# Altium schematic sheet MB988.SchDoc
size A3; Revision: B.2
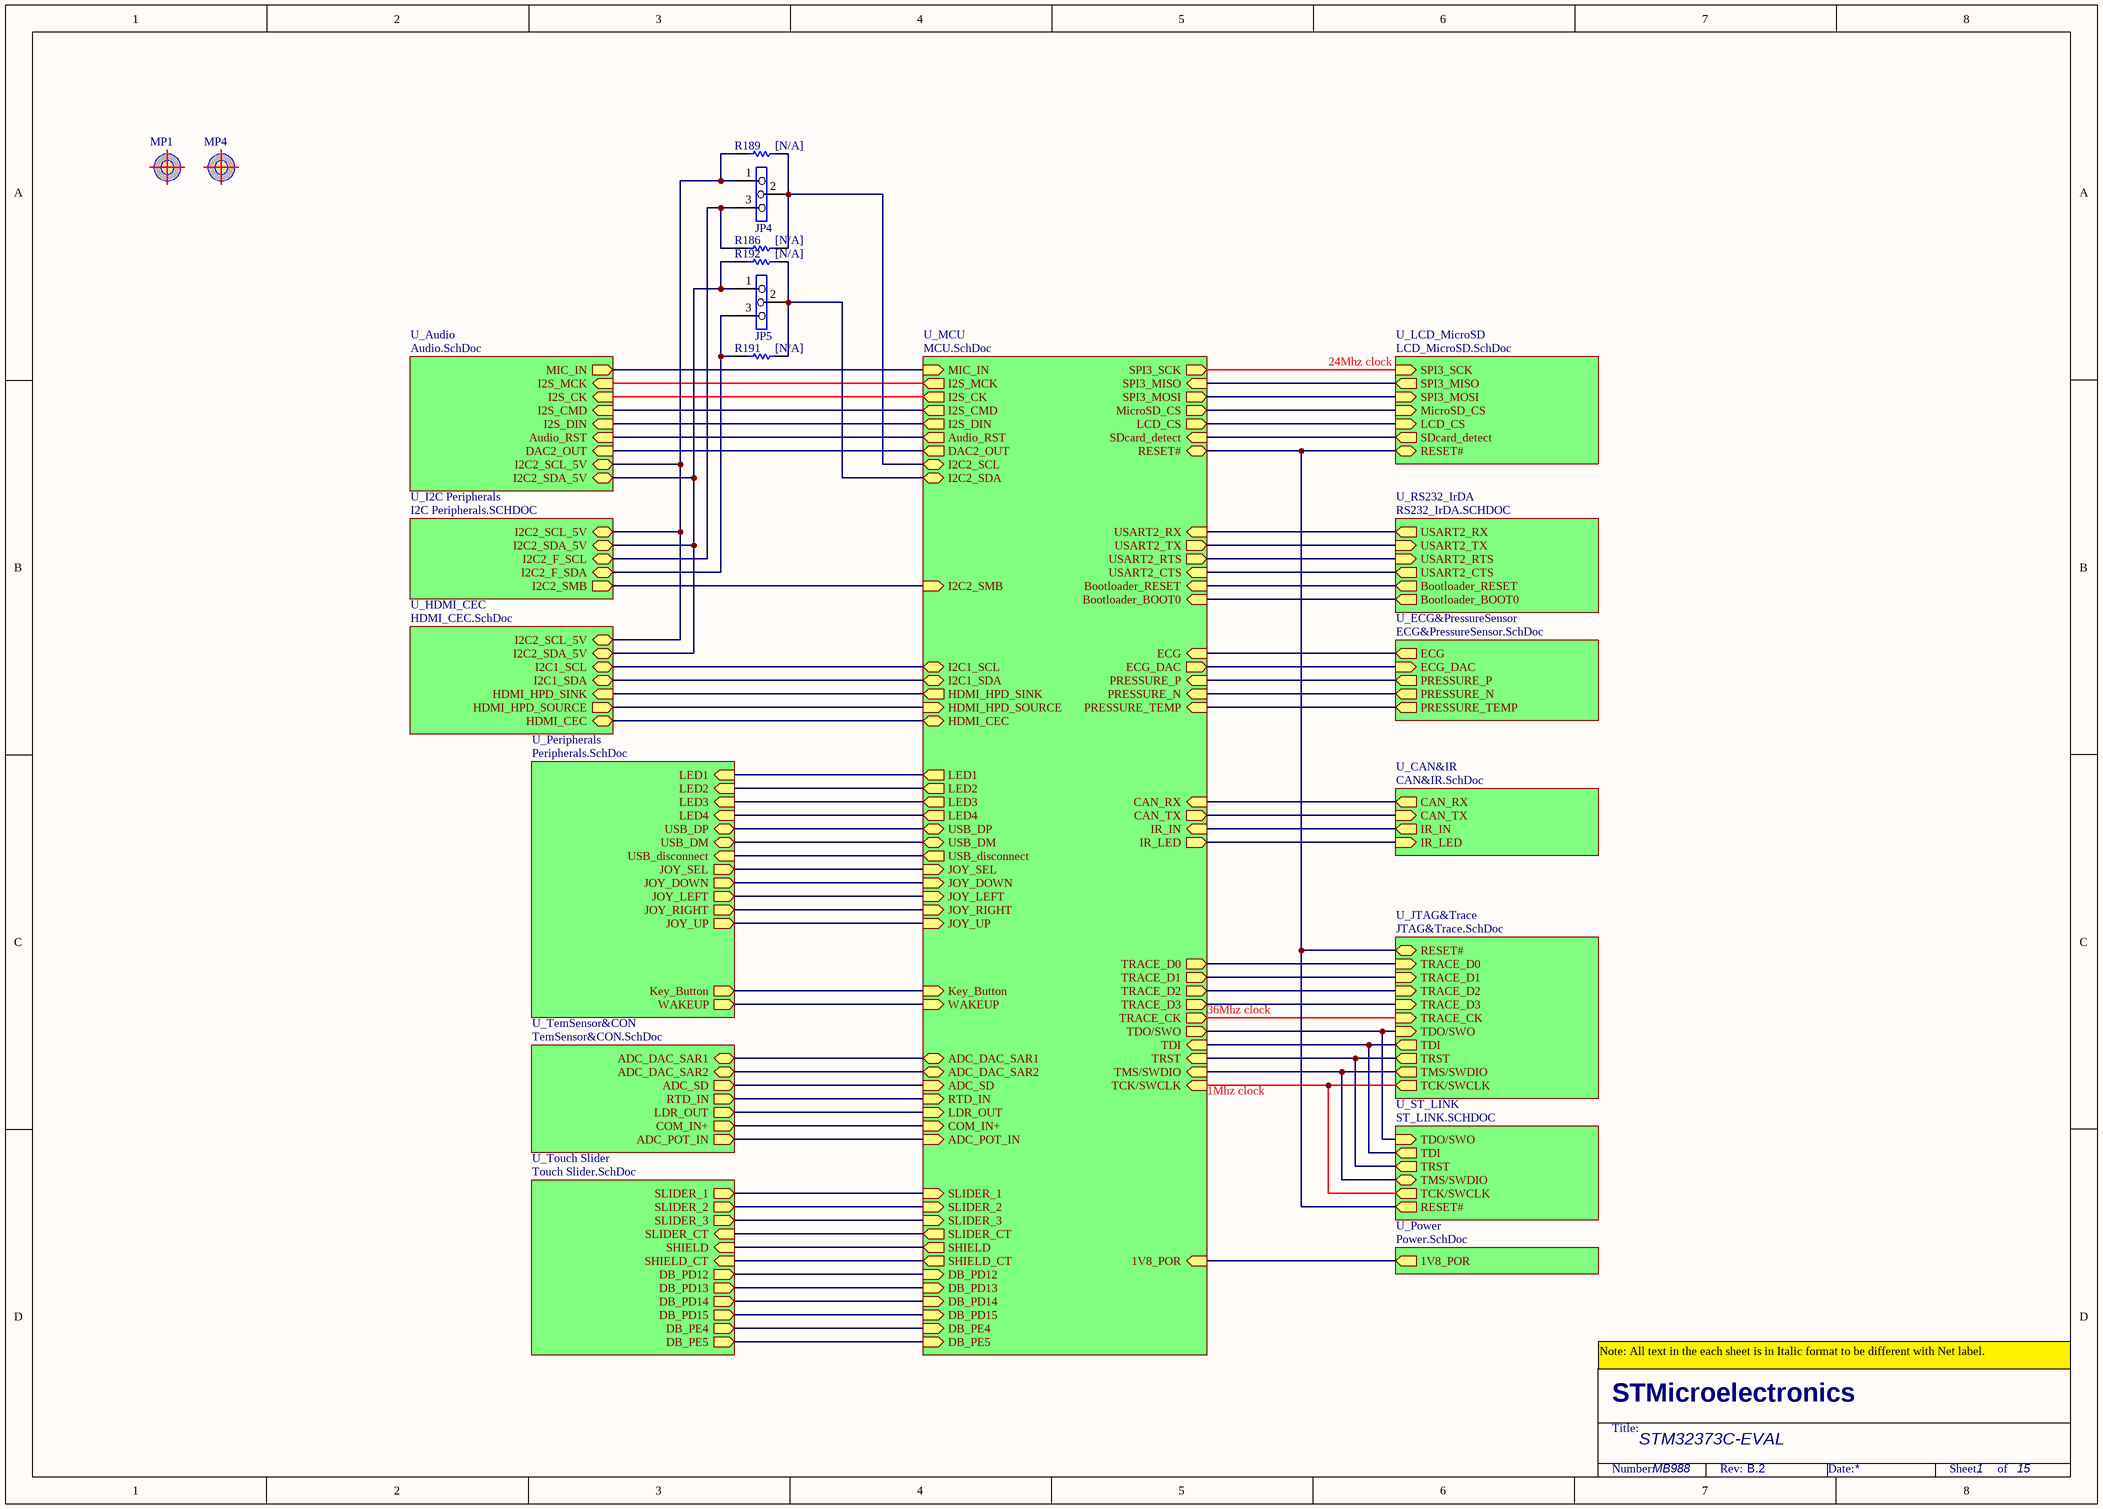
[diagram p0: MB988.SchDoc]

## Parts
JP4  (no value)  [SIP3]
JP5  (no value)  [SIP3]
MP1  (no value)  [markpoint_1.0]
MP4  (no value)  [markpoint_1.0]
R186  [N/A]  [0603R]
R189  [N/A]  [0603R]
R191  [N/A]  [0603R]
R192  [N/A]  [0603R]

## Sub-sheets
U_Audio = Audio.SchDoc: I2S_CMD (in), I2S_DIN (in), I2S_CK (in), I2C2_SCL_5V (bidir), I2C2_SDA_5V (bidir), Audio_RST (in), I2S_MCK (in), DAC2_OUT (in), MIC_IN (out)
U_CAN&IR = CAN&IR.SchDoc: CAN_TX (in), CAN_RX (out), IR_LED (in), IR_IN (out)
U_ECG&PressureSensor = ECG&PressureSensor.SchDoc: ECG (out), PRESSURE_P (out), PRESSURE_N (out), ECG_DAC (in), PRESSURE_TEMP (out)
U_HDMI_CEC = HDMI_CEC.SchDoc: HDMI_HPD_SINK (in), I2C2_SDA_5V (bidir), I2C2_SCL_5V (bidir), HDMI_CEC (bidir), HDMI_HPD_SOURCE (out), I2C1_SCL (bidir), I2C1_SDA (bidir)
U_I2C Peripherals = I2C Peripherals.SCHDOC: I2C2_SCL_5V (bidir), I2C2_SDA_5V (bidir), I2C2_SMB (out), I2C2_F_SDA (bidir), I2C2_F_SCL (bidir)
U_JTAG&Trace = JTAG&Trace.SchDoc: TDI (out), RESET# (bidir), TRACE_D3 (in), TRACE_D2 (in), TRACE_D1 (in), TRACE_D0 (in), TRACE_CK (in), TRST (out), TMS/SWDIO (out), TCK/SWCLK (out), TDO/SWO (in)
U_LCD_MicroSD = LCD_MicroSD.SchDoc: MicroSD_CS (in), SPI3_SCK (in), SPI3_MOSI (in), LCD_CS (in), SPI3_MISO (out), SDcard_detect (out), RESET# (bidir)
U_MCU = MCU.SchDoc: WAKEUP (in), HDMI_HPD_SOURCE (in), SLIDER_3 (in), ADC_DAC_SAR2 (bidir), USB_DM (bidir), I2C2_SCL (bidir), I2C2_SDA (bidir), TMS/SWDIO (in), TCK/SWCLK (in), TDI (in), MIC_IN (in), COM_IN+ (in), TDO/SWO (out), TRST (in), IR_IN (in), HDMI_CEC (bidir), IR_LED (out), RESET# (bidir), LDR_OUT (in), SLIDER_2 (in), SLIDER_1 (in), USART2_RX (in), USART2_TX (out), USART2_RTS (out), USART2_CTS (in), ECG (in), ADC_SD (in), PRESSURE_N (in), PRESSURE_P (in), SPI3_MOSI (out), SPI3_MISO (in), SPI3_SCK (out), LED4 (out), LED3 (out), LED1 (out), I2S_MCK (out), I2S_CK (out), I2S_CMD (out), LED2 (out), Bootloader_BOOT0 (in), Bootloader_RESET (in), ADC_DAC_SAR1 (bidir), I2S_DIN (out), I2C2_SMB (in), USB_DP (bidir), CAN_RX (in), CAN_TX (out), SLIDER_CT (out), MicroSD_CS (out), TRACE_D0 (out), TRACE_D1 (out), Key_Button (in), JOY_SEL (in), RTD_IN (in), PRESSURE_TEMP (in), JOY_DOWN (in), JOY_LEFT (in), JOY_UP (in), JOY_RIGHT (in), DAC2_OUT (out), TRACE_CK (out), LCD_CS (out), SHIELD (out), TRACE_D2 (out), SHIELD_CT (out), TRACE_D3 (out), HDMI_HPD_SINK (out), Audio_RST (out), SDcard_detect (in), ECG_DAC (out), ADC_POT_IN (in), DB_PD14 (in), DB_PD13 (in), DB_PD12 (in), DB_PD15 (in), 1V8_POR (in), USB_disconnect (out), I2C1_SCL (bidir), I2C1_SDA (bidir), DB_PE4 (in), DB_PE5 (in)
U_Peripherals = Peripherals.SchDoc: LED4 (in), LED3 (in), LED1 (in), LED2 (in), JOY_SEL (out), JOY_DOWN (out), JOY_LEFT (out), JOY_RIGHT (out), JOY_UP (out), USB_DM (bidir), USB_DP (bidir), WAKEUP (out), Key_Button (out), USB_disconnect (in)
U_Power = Power.SchDoc: 1V8_POR (out)
U_RS232_IrDA = RS232_IrDA.SCHDOC: USART2_TX (in), USART2_CTS (out), Bootloader_RESET (out), Bootloader_BOOT0 (out), USART2_RX (out), USART2_RTS (in)
U_ST_LINK = ST_LINK.SCHDOC: TDI (out), TRST (out), TMS/SWDIO (bidir), TCK/SWCLK (out), TDO/SWO (in), RESET# (out)
U_TemSensor&CON = TemSensor&CON.SchDoc: RTD_IN (out), LDR_OUT (out), COM_IN+ (out), ADC_POT_IN (out), ADC_DAC_SAR1 (bidir), ADC_SD (out), ADC_DAC_SAR2 (bidir)
U_Touch Slider = Touch Slider.SchDoc: SLIDER_2 (out), SLIDER_3 (out), SHIELD (in), SHIELD_CT (in), SLIDER_1 (out), DB_PD14 (out), DB_PD13 (out), DB_PD12 (out), SLIDER_CT (in), DB_PD15 (out), DB_PE4 (out), DB_PE5 (out)

## Nets
NetJP4_1: JP4.1 R189.2 ; sheet U_Audio/I2C2_SCL_5V, sheet U_I2C Peripherals/I2C2_SCL_5V, sheet U_HDMI_CEC/I2C2_SCL_5V
NetJP4_2: JP4.2 R186.1 R189.1 ; sheet U_MCU/I2C2_SCL
NetJP4_3: JP4.3 R186.2 ; sheet U_I2C Peripherals/I2C2_F_SCL
NetJP5_1: JP5.1 R192.2 ; sheet U_Audio/I2C2_SDA_5V, sheet U_I2C Peripherals/I2C2_SDA_5V, sheet U_HDMI_CEC/I2C2_SDA_5V
NetJP5_2: JP5.2 R191.1 R192.1 ; sheet U_MCU/I2C2_SDA
NetJP5_3: JP5.3 R191.2 ; sheet U_I2C Peripherals/I2C2_F_SDA
(unnamed): sheet U_MCU/WAKEUP, sheet U_Peripherals/WAKEUP
(unnamed): sheet U_MCU/HDMI_HPD_SOURCE, sheet U_HDMI_CEC/HDMI_HPD_SOURCE
(unnamed): sheet U_MCU/SLIDER_3, sheet U_Touch Slider/SLIDER_3
(unnamed): sheet U_MCU/ADC_DAC_SAR2, sheet U_TemSensor&CON/ADC_DAC_SAR2
(unnamed): sheet U_MCU/USB_DM, sheet U_Peripherals/USB_DM
(unnamed): sheet U_MCU/TMS/SWDIO, sheet U_JTAG&Trace/TMS/SWDIO, sheet U_ST_LINK/TMS/SWDIO
(unnamed): sheet U_MCU/TCK/SWCLK, sheet U_JTAG&Trace/TCK/SWCLK, sheet U_ST_LINK/TCK/SWCLK
(unnamed): sheet U_MCU/TDI, sheet U_JTAG&Trace/TDI, sheet U_ST_LINK/TDI
(unnamed): sheet U_MCU/MIC_IN, sheet U_Audio/MIC_IN
(unnamed): sheet U_MCU/COM_IN+, sheet U_TemSensor&CON/COM_IN+
(unnamed): sheet U_MCU/TDO/SWO, sheet U_JTAG&Trace/TDO/SWO, sheet U_ST_LINK/TDO/SWO
(unnamed): sheet U_MCU/TRST, sheet U_JTAG&Trace/TRST, sheet U_ST_LINK/TRST
(unnamed): sheet U_MCU/IR_IN, sheet U_CAN&IR/IR_IN
(unnamed): sheet U_MCU/HDMI_CEC, sheet U_HDMI_CEC/HDMI_CEC
(unnamed): sheet U_MCU/IR_LED, sheet U_CAN&IR/IR_LED
(unnamed): sheet U_MCU/RESET#, sheet U_JTAG&Trace/RESET#, sheet U_ST_LINK/RESET#, sheet U_LCD_MicroSD/RESET#
(unnamed): sheet U_MCU/LDR_OUT, sheet U_TemSensor&CON/LDR_OUT
(unnamed): sheet U_MCU/SLIDER_2, sheet U_Touch Slider/SLIDER_2
(unnamed): sheet U_MCU/SLIDER_1, sheet U_Touch Slider/SLIDER_1
(unnamed): sheet U_MCU/USART2_RX, sheet U_RS232_IrDA/USART2_RX
(unnamed): sheet U_MCU/USART2_TX, sheet U_RS232_IrDA/USART2_TX
(unnamed): sheet U_MCU/USART2_RTS, sheet U_RS232_IrDA/USART2_RTS
(unnamed): sheet U_MCU/USART2_CTS, sheet U_RS232_IrDA/USART2_CTS
(unnamed): sheet U_MCU/ECG, sheet U_ECG&PressureSensor/ECG
(unnamed): sheet U_MCU/ADC_SD, sheet U_TemSensor&CON/ADC_SD
(unnamed): sheet U_MCU/PRESSURE_N, sheet U_ECG&PressureSensor/PRESSURE_N
(unnamed): sheet U_MCU/PRESSURE_P, sheet U_ECG&PressureSensor/PRESSURE_P
(unnamed): sheet U_MCU/SPI3_MOSI, sheet U_LCD_MicroSD/SPI3_MOSI
(unnamed): sheet U_MCU/SPI3_MISO, sheet U_LCD_MicroSD/SPI3_MISO
(unnamed): sheet U_MCU/SPI3_SCK, sheet U_LCD_MicroSD/SPI3_SCK
(unnamed): sheet U_MCU/LED4, sheet U_Peripherals/LED4
(unnamed): sheet U_MCU/LED3, sheet U_Peripherals/LED3
(unnamed): sheet U_MCU/LED1, sheet U_Peripherals/LED1
(unnamed): sheet U_MCU/I2S_MCK, sheet U_Audio/I2S_MCK
(unnamed): sheet U_MCU/I2S_CK, sheet U_Audio/I2S_CK
(unnamed): sheet U_MCU/I2S_CMD, sheet U_Audio/I2S_CMD
(unnamed): sheet U_MCU/LED2, sheet U_Peripherals/LED2
(unnamed): sheet U_MCU/Bootloader_BOOT0, sheet U_RS232_IrDA/Bootloader_BOOT0
(unnamed): sheet U_MCU/Bootloader_RESET, sheet U_RS232_IrDA/Bootloader_RESET
(unnamed): sheet U_MCU/ADC_DAC_SAR1, sheet U_TemSensor&CON/ADC_DAC_SAR1
(unnamed): sheet U_MCU/I2S_DIN, sheet U_Audio/I2S_DIN
(unnamed): sheet U_MCU/I2C2_SMB, sheet U_I2C Peripherals/I2C2_SMB
(unnamed): sheet U_MCU/USB_DP, sheet U_Peripherals/USB_DP
(unnamed): sheet U_MCU/CAN_RX, sheet U_CAN&IR/CAN_RX
(unnamed): sheet U_MCU/CAN_TX, sheet U_CAN&IR/CAN_TX
(unnamed): sheet U_MCU/SLIDER_CT, sheet U_Touch Slider/SLIDER_CT
(unnamed): sheet U_MCU/MicroSD_CS, sheet U_LCD_MicroSD/MicroSD_CS
(unnamed): sheet U_MCU/TRACE_D0, sheet U_JTAG&Trace/TRACE_D0
(unnamed): sheet U_MCU/TRACE_D1, sheet U_JTAG&Trace/TRACE_D1
(unnamed): sheet U_MCU/Key_Button, sheet U_Peripherals/Key_Button
(unnamed): sheet U_MCU/JOY_SEL, sheet U_Peripherals/JOY_SEL
(unnamed): sheet U_MCU/RTD_IN, sheet U_TemSensor&CON/RTD_IN
(unnamed): sheet U_MCU/PRESSURE_TEMP, sheet U_ECG&PressureSensor/PRESSURE_TEMP
(unnamed): sheet U_MCU/JOY_DOWN, sheet U_Peripherals/JOY_DOWN
(unnamed): sheet U_MCU/JOY_LEFT, sheet U_Peripherals/JOY_LEFT
(unnamed): sheet U_MCU/JOY_UP, sheet U_Peripherals/JOY_UP
(unnamed): sheet U_MCU/JOY_RIGHT, sheet U_Peripherals/JOY_RIGHT
(unnamed): sheet U_MCU/DAC2_OUT, sheet U_Audio/DAC2_OUT
(unnamed): sheet U_MCU/TRACE_CK, sheet U_JTAG&Trace/TRACE_CK
(unnamed): sheet U_MCU/LCD_CS, sheet U_LCD_MicroSD/LCD_CS
(unnamed): sheet U_MCU/SHIELD, sheet U_Touch Slider/SHIELD
(unnamed): sheet U_MCU/TRACE_D2, sheet U_JTAG&Trace/TRACE_D2
(unnamed): sheet U_MCU/SHIELD_CT, sheet U_Touch Slider/SHIELD_CT
(unnamed): sheet U_MCU/TRACE_D3, sheet U_JTAG&Trace/TRACE_D3
(unnamed): sheet U_MCU/HDMI_HPD_SINK, sheet U_HDMI_CEC/HDMI_HPD_SINK
(unnamed): sheet U_MCU/Audio_RST, sheet U_Audio/Audio_RST
(unnamed): sheet U_MCU/SDcard_detect, sheet U_LCD_MicroSD/SDcard_detect
(unnamed): sheet U_MCU/ECG_DAC, sheet U_ECG&PressureSensor/ECG_DAC
(unnamed): sheet U_MCU/ADC_POT_IN, sheet U_TemSensor&CON/ADC_POT_IN
(unnamed): sheet U_MCU/DB_PD14, sheet U_Touch Slider/DB_PD14
(unnamed): sheet U_MCU/DB_PD13, sheet U_Touch Slider/DB_PD13
(unnamed): sheet U_MCU/DB_PD12, sheet U_Touch Slider/DB_PD12
(unnamed): sheet U_MCU/DB_PD15, sheet U_Touch Slider/DB_PD15
(unnamed): sheet U_MCU/1V8_POR, sheet U_Power/1V8_POR
(unnamed): sheet U_MCU/USB_disconnect, sheet U_Peripherals/USB_disconnect
(unnamed): sheet U_MCU/I2C1_SCL, sheet U_HDMI_CEC/I2C1_SCL
(unnamed): sheet U_MCU/I2C1_SDA, sheet U_HDMI_CEC/I2C1_SDA
(unnamed): sheet U_MCU/DB_PE4, sheet U_Touch Slider/DB_PE4
(unnamed): sheet U_MCU/DB_PE5, sheet U_Touch Slider/DB_PE5

## Notes on the sheet
- 24Mhz clock
- 36Mhz clock
- 1Mhz clock
- Note: All text in the each sheet is in Italic format to be different with Net label.
- STM32373C-EVAL
- MB988
- 1
- 15
- STMicroelectronics
- Title:
- Number:
- Rev:
- Date:
- Sheet       of

## Library data of the parts
JP4 JP5 = Jumper3
MP1 MP4 = MARKPOINT
R186 R189 R191 R192 = Res1: Resistor; Value: 1K; Published: 8-Jun-2000; Revision: July-2002: Re-released for DXP Platform.; Publisher: Altium Limited